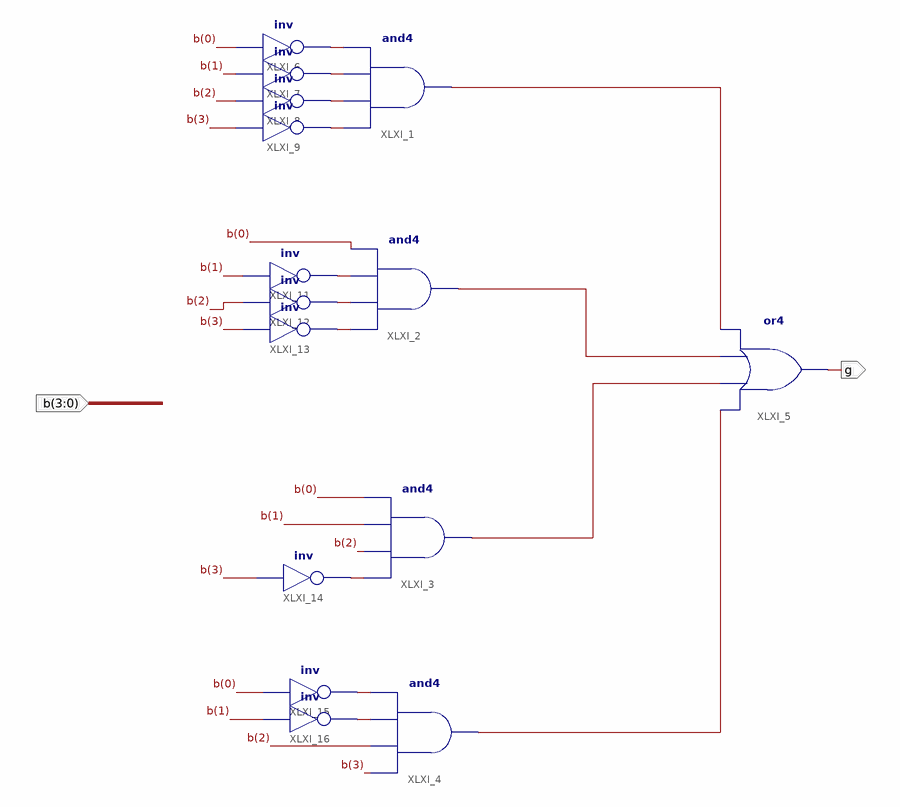
[diagram p0: schematic sheet 1]
// Xilinx ISE schematic g.sch (artix7) as structural Verilog: 15 symbols, 2 ports
module g (
  input  [3:0] b,
  output g
);

  wire XLXN_2, XLXN_3, XLXN_4, XLXN_5, XLXN_6, XLXN_7, XLXN_8, XLXN_9, XLXN_10, XLXN_11, XLXN_12, XLXN_13,
       XLXN_14, XLXN_15;

  and XLXI_1 (XLXN_12, XLXN_5, XLXN_4, XLXN_3, XLXN_2);
  and XLXI_2 (XLXN_13, XLXN_8, XLXN_7, XLXN_6, b[0]);
  and XLXI_3 (XLXN_14, XLXN_9, b[2], b[1], b[0]);
  and XLXI_4 (XLXN_15, b[3], b[2], XLXN_11, XLXN_10);
  or XLXI_5 (g, XLXN_15, XLXN_14, XLXN_13, XLXN_12);
  not XLXI_6 (XLXN_2, b[0]);
  not XLXI_7 (XLXN_3, b[1]);
  not XLXI_8 (XLXN_4, b[2]);
  not XLXI_9 (XLXN_5, b[3]);
  not XLXI_11 (XLXN_6, b[1]);
  not XLXI_12 (XLXN_7, b[2]);
  not XLXI_13 (XLXN_8, b[3]);
  not XLXI_14 (XLXN_9, b[3]);
  not XLXI_15 (XLXN_10, b[0]);
  not XLXI_16 (XLXN_11, b[1]);
endmodule
